# Altium schematic sheet 101_Power.SchDoc: Power DevKIT
size A2; Organization: Greenfield Tech Solutions; Address1: Molendreef 33; Address2: Ossendrecht; Address3: 4641CS; Address4: The Netherlands; SheetNumber: 2; SheetTotal: 8
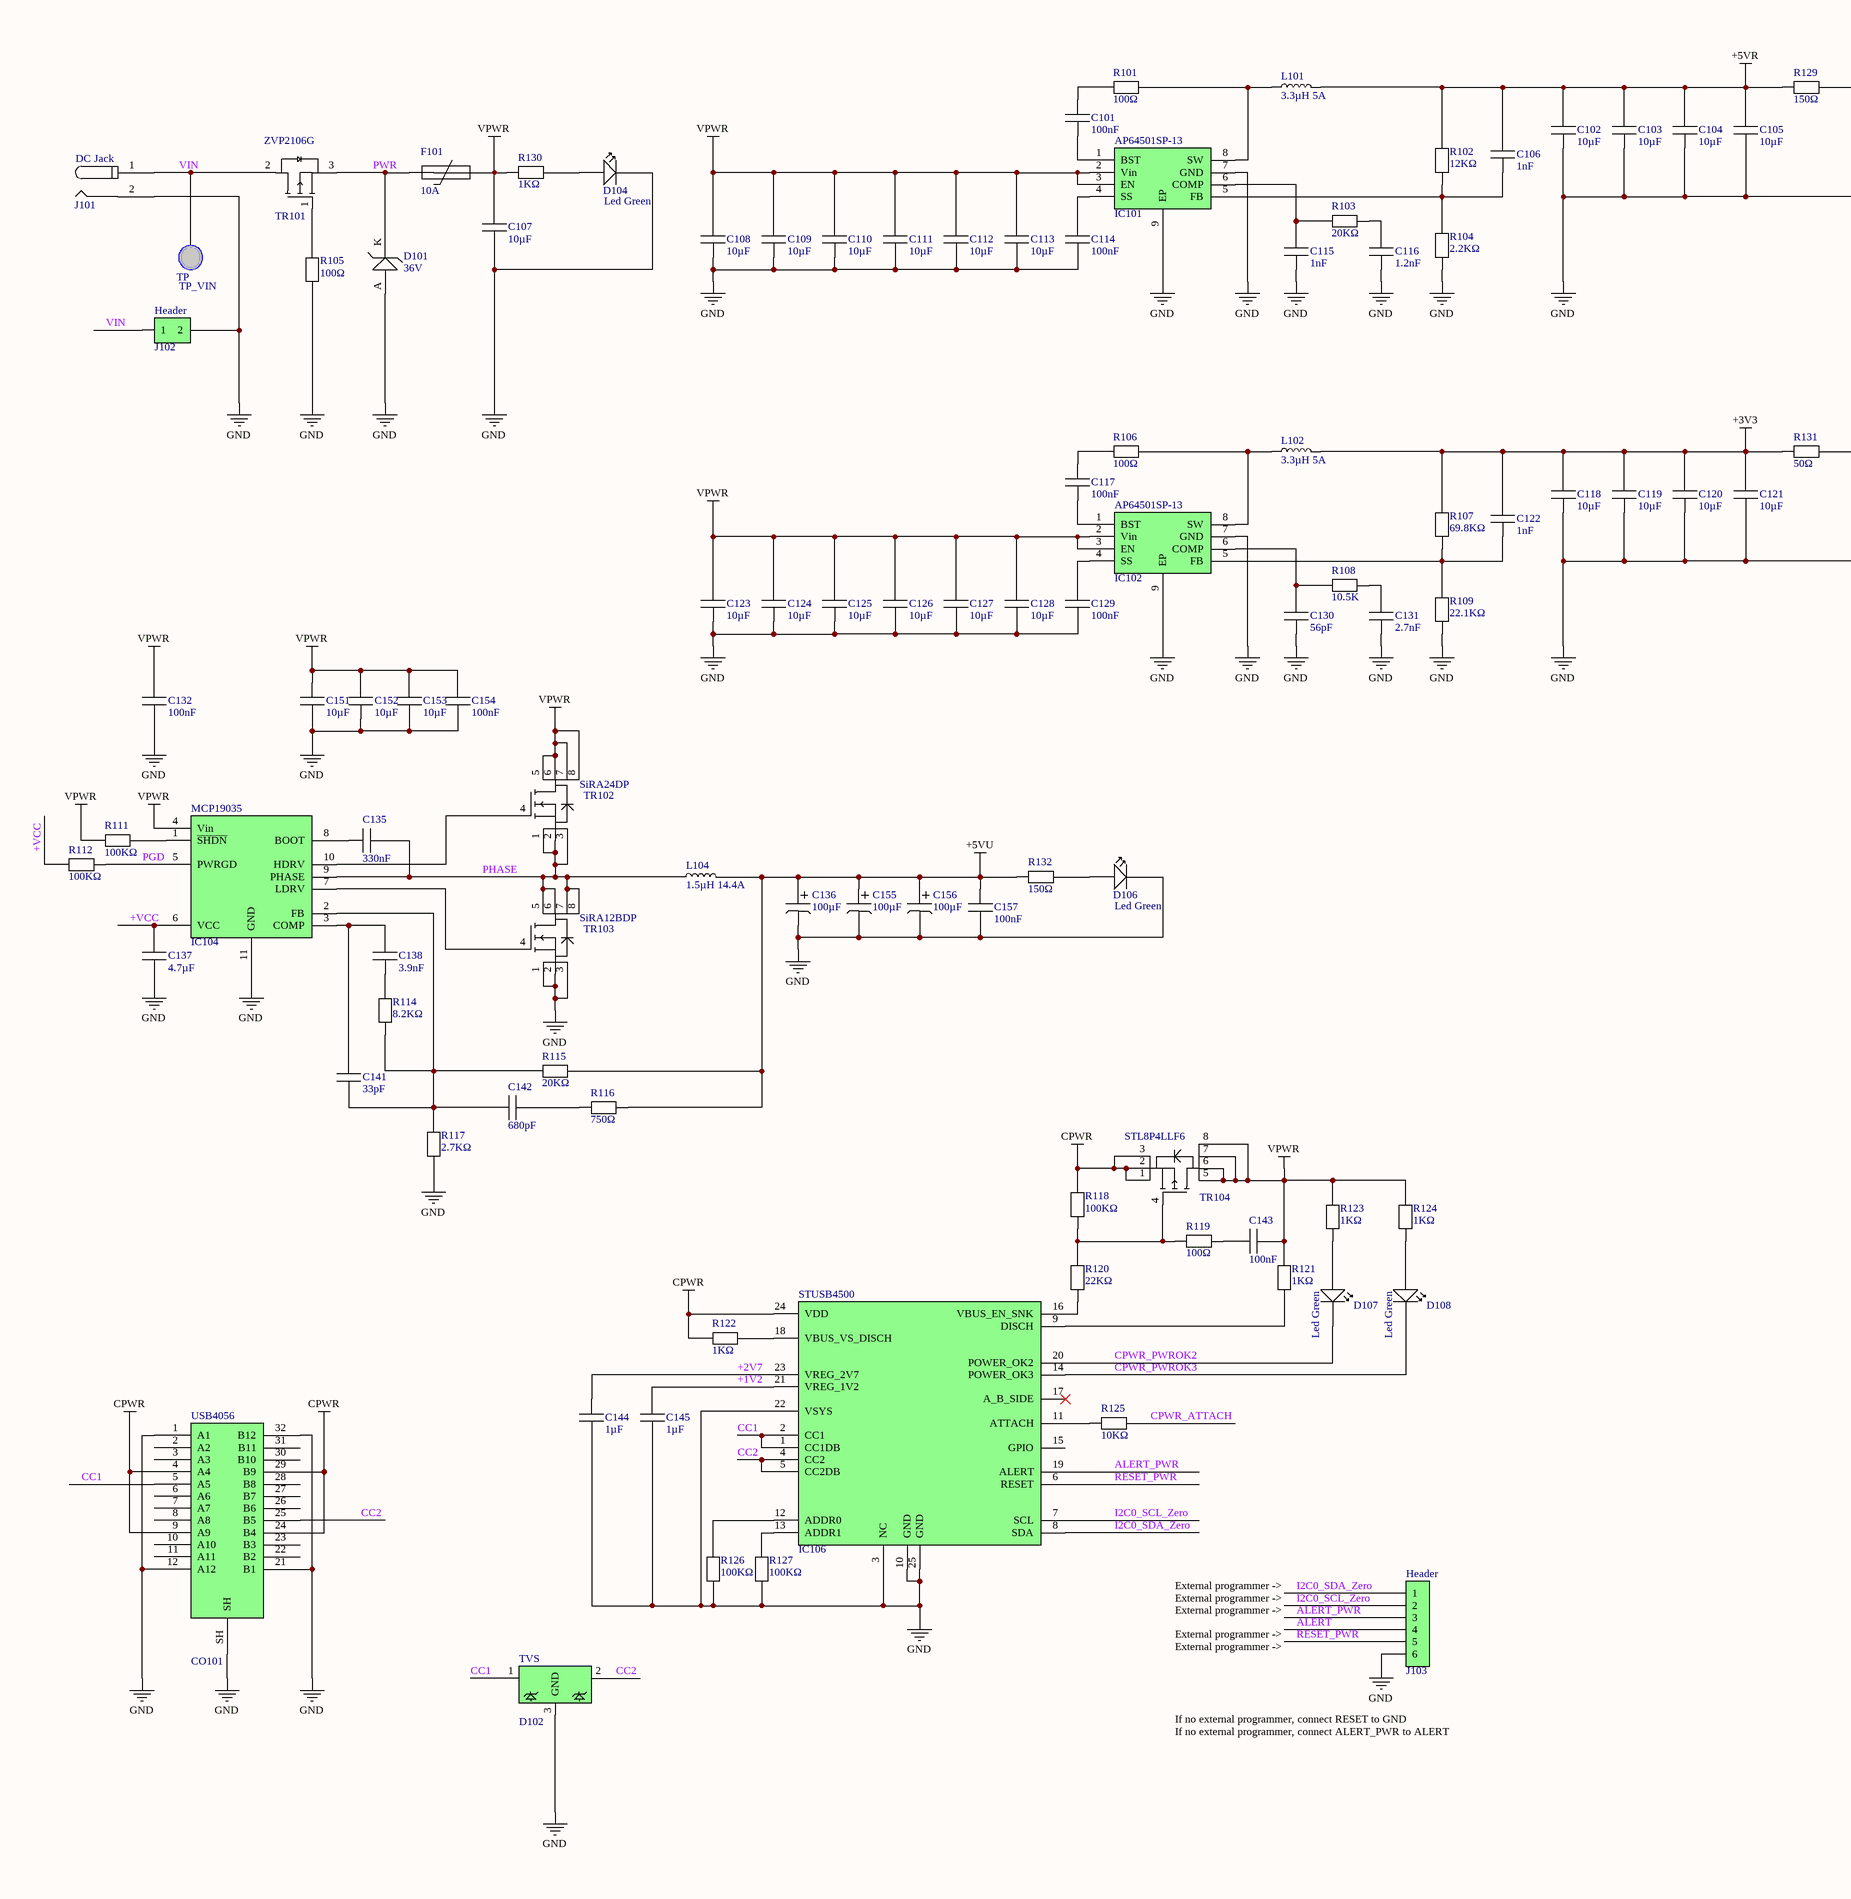
[diagram p0: 101_Power.SchDoc, left]
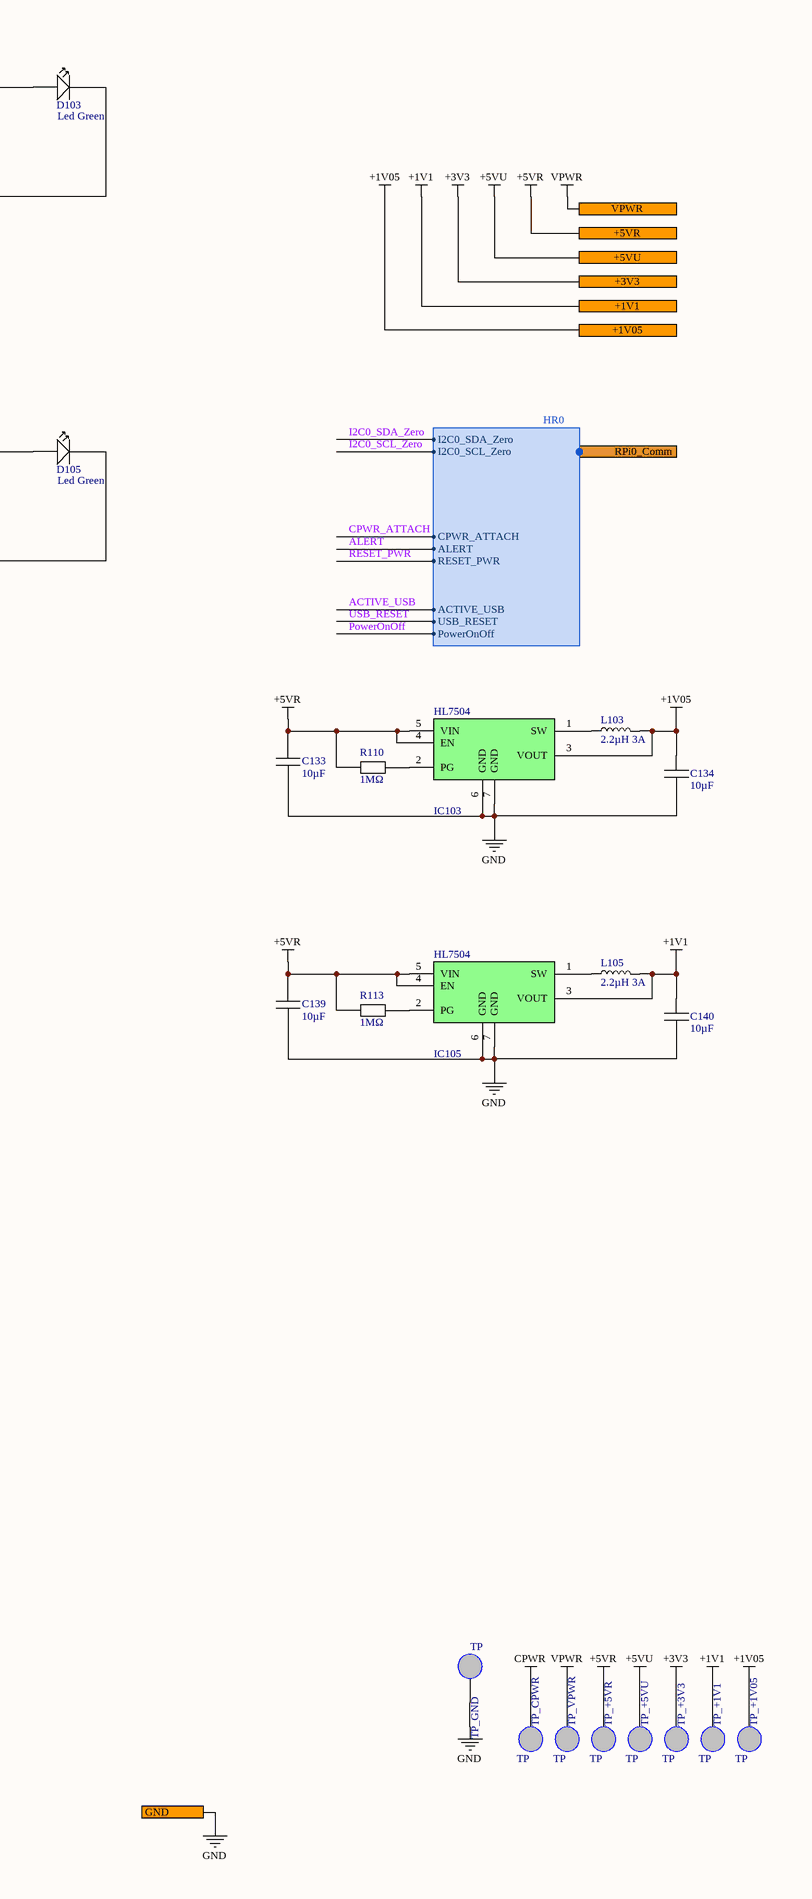
[diagram p1: 101_Power.SchDoc, right]

## Parts
C101  100nF  [C0402]
C102  10µF  [C0805]
C103  10µF  [C0805]
C104  10µF  [C0805]
C105  10µF  [C0805]
C106  1nF  [C0402]
C107  10µF  [C1210]
C108  10µF  [C0805]
C109  10µF  [C0805]
C110  10µF  [C0805]
C111  10µF  [C0805]
C112  10µF  [C0805]
C113  10µF  [C0805]
C114  100nF  [C0402]
C115  1nF  [C0402]
C116  1.2nF  [C0402]
C117  100nF  [C0402]
C118  10µF  [C0805]
C119  10µF  [C0805]
C120  10µF  [C0805]
C121  10µF  [C0805]
C122  1nF  [C0402]
C123  10µF  [C0805]
C124  10µF  [C0805]
C125  10µF  [C0805]
C126  10µF  [C0805]
C127  10µF  [C0805]
C128  10µF  [C0805]
C129  100nF  [C0402]
C130  56pF  [C0402]
C131  2.7nF  [C0402]
C132  100nF  [C0805]
C133  10µF  [C0603]
C134  10µF  [C0603]
C135  330nF  [C0603]
C136  100µF  [RL_6.3_2.5_11]
C137  4.7µF  [C0603]
C138  3.9nF  [C0402]
C139  10µF  [C0603]
C140  10µF  [C0603]
C141  33pF  [C0402]
C142  680pF  [C0402]
C143  100nF  [C0402]
C144  1µF  [C0603]
C145  1µF  [C0603]
C151  10µF  [C1210]
C152  10µF  [C1210]
C153  10µF  [C1210]
C154  100nF  [C0805]
C155  100µF  [RL_6.3_2.5_11]
C156  100µF  [RL_6.3_2.5_11]
C157  100nF  [C0805]
CO101  USB4056  [USB4056-03-A]
D101  36V  [SOD-323]
D102  TVS  [SOT-323]
D103  Led Green  [Led0805]
D104  Led Green  [Led0805]
D105  Led Green  [Led0805]
D106  Led Green  [Led0805]
D107  Led Green  [Led0805]
D108  Led Green  [Led0805]
F101  10A  [F1206]
IC101  AP64501SP-13  [SO-8-EP]
IC102  AP64501SP-13  [SO-8-EP]
IC103  HL7504  [DFN-6G_2X2]
IC104  MCP19035  [DFN-10G_3X3]
IC105  HL7504  [DFN-6G_2X2]
IC106  STUSB4500  [QFN-24G_4X4]
J101  DC Jack  [PJ-082BH]
J102  Header  [1X2P_2.54mm]
J103  Header  [1X6P_2.54MM_SMT]
L101  3.3µH 5A  [SRN6045TA]
L102  3.3µH 5A  [SRN6045TA]
L103  2.2µH 3A  [NRS4018]
L104  1.5µH 14.4A  [0630CDMCDDS]
L105  2.2µH 3A  [NRS4018]
R101  100Ω  [R0603]
R102  12KΩ  [R0402]
R103  20KΩ  [R0402]
R104  2.2KΩ  [R0402]
R105  100Ω  [R0603]
R106  100Ω  [R0603]
R107  69.8KΩ  [R0603]
R108  10.5K  [R0402]
R109  22.1KΩ  [R0603]
R110  1MΩ  [R0402]
R111  100KΩ  [R0402]
R112  100KΩ  [R0402]
R113  1MΩ  [R0402]
R114  8.2KΩ  [R0402]
R115  20KΩ  [R0402]
R116  750Ω  [R0402]
R117  2.7KΩ  [R0402]
R118  100KΩ  [R0402]
R119  100Ω  [R0603]
R120  22KΩ  [R0402]
R121  1KΩ  [R0603]
R122  1KΩ  [R0603]
R123  1KΩ  [R0402]
R124  1KΩ  [R0402]
R125  10KΩ  [R0402]
R126  100KΩ  [R0402]
R127  100KΩ  [R0402]
R129  150Ω  [R0603]
R130  1KΩ  [R0603]
R131  50Ω  [R0603]
R132  150Ω  [R0603]
TP_+1V1  TP  [TP_1MM]
TP_+1V05  TP  [TP_1MM]
TP_+3V3  TP  [TP_1MM]
TP_+5VR  TP  [TP_1MM]
TP_+5VU  TP  [TP_1MM]
TP_CPWR  TP  [TP_1MM]
TP_GND  TP  [TP_1MM]
TP_VIN  TP  [TP_1MM]
TP_VPWR  TP  [TP_1MM]
TR101  ZVP2106G  [SOT-223]
TR102  SiRA24DP  [PowerPAK-SO-8_5X6]
TR103  SiRA12BDP  [PowerPAK-SO-8_5X6]
TR104  STL8P4LLF6  [PowerFLAT-3.3x3.3-8]

## Ports
+1V1, +1V05, +3V3, +5VR, +5VU, GND, RPi0_Comm (harness HR0), VPWR

## Harnesses
HR0: I2C0_SCL_Zero, I2C0_SDA_Zero, CPWR_ATTACH, PowerOnOff, USB_RESET, ACTIVE_USB, ALERT, RESET_PWR

## Nets
+1V1: C140.1 IC105.3(VOUT) L105.2 TP_+1V1.1 ; port +1V1
+1V05: C134.1 IC103.3(VOUT) L103.2 TP_+1V05.1 ; port +1V05
+3V3: C118.1 C119.1 C120.1 C121.1 C122.1 L102.2 R107.2 R131.1 TP_+3V3.1 ; port +3V3
+5VR: C102.1 C103.1 C104.1 C105.1 C106.1 C133.1 C139.1 IC103.4(EN) IC103.5(VIN) IC105.4(EN) IC105.5(VIN) L101.2 R102.2 R110.1 R113.1 R129.1 TP_+5VR.1 ; port +5VR
+5VU: C136.1 C155.1 C156.1 C157.1 L104.2 R115.2 R116.2 R132.1 TP_+5VU.1 ; port +5VU
CPWR: CO101.4(A4) CO101.9(A9) CO101.24(B4) CO101.29(B9) IC106.24(VDD) R118.2 R122.1 TP_CPWR.1 TR104.1(S) TR104.2(S) TR104.3(S)
GND: C102.2 C103.2 C104.2 C105.2 C107.2 C108.2 C109.2 C110.2 C111.2 C112.2 C113.2 C114.2 C115.2 C116.2 C118.2 C119.2 C120.2 C121.2 C123.2 C124.2 C125.2 C126.2 C127.2 C128.2 C129.2 C130.2 C131.2 C132.2 C133.2 C134.2 C136.2 C137.2 C139.2 C140.2 C144.2 C145.2 C151.2 C152.2 C153.2 C154.2 C155.2 C156.2 C157.2 CO101.1(A1) CO101.12(A12) CO101.21(B1) CO101.32(B12) CO101.SH D101.A D102.3(GND) D103.K D104.K D105.K D106.K IC101.7(GND) IC101.9(EP) IC102.7(GND) IC102.9(EP) IC103.6(GND) IC103.7(GND) IC104.11(GND) IC105.6(GND) IC105.7(GND) IC106.3(NC) IC106.10(GND) IC106.22(VSYS) IC106.25(GND) J101.2 J102.2 J103.6 R104.1 R105.1 R109.1 R117.1 R126.1 R127.1 TP_GND.1 TR103.1(S) TR103.2(S) TR103.3(S) ; port GND
VPWR: C107.1 C108.1 C109.1 C110.1 C111.1 C112.1 C113.1 C123.1 C124.1 C125.1 C126.1 C127.1 C128.1 C132.1 C143.2 C151.1 C152.1 C153.1 C154.1 F101.2 IC101.2(Vin) IC101.3(EN) IC102.2(Vin) IC102.3(EN) IC104.4(Vin) R111.1 R121.2 R123.2 R124.2 R130.1 TP_VPWR.1 TR102.5(D) TR102.6(D) TR102.7(D) TR102.8(D) TR104.5(D) TR104.6(D) TR104.7(D) TR104.8(D) ; port VPWR
+1V2: C145.1 IC106.21(VREG_1V2)
+2V7: C144.1 IC106.23(VREG_2V7)
+VCC: C137.1 IC104.6(VCC) R112.1
ACTIVE_USB: port RPi0_Comm.ACTIVE_USB
ALERT: J103.4 ; port RPi0_Comm.ALERT
ALERT_PWR: IC106.19(ALERT) J103.3
CC1: CO101.5(A5) D102.1 IC106.1(CC1DB) IC106.2(CC1)
CC2: CO101.25(B5) D102.2 IC106.4(CC2) IC106.5(CC2DB)
CPWR_ATTACH: R125.2 ; port RPi0_Comm.CPWR_ATTACH
CPWR_PWROK2: D107.K IC106.20(POWER_OK2)
CPWR_PWROK3: D108.K IC106.14(POWER_OK3)
I2C0_SCL_Zero: IC106.7(SCL) J103.2 ; port RPi0_Comm.I2C0_SCL_Zero
I2C0_SDA_Zero: IC106.8(SDA) J103.1 ; port RPi0_Comm.I2C0_SDA_Zero
PGD: IC104.5(PWRGD) R112.2
PHASE: C135.2 IC104.9(PHASE) L104.1 TR102.1(S) TR102.2(S) TR102.3(S) TR103.5(D) TR103.6(D) TR103.7(D) TR103.8(D)
PowerOnOff: port RPi0_Comm.PowerOnOff
PWR: D101.K F101.1 TR101.3(S)
RESET_PWR: IC106.6(RESET) J103.5 ; port RPi0_Comm.RESET_PWR
USB_RESET: port RPi0_Comm.USB_RESET
VIN: J101.1 J102.1 TP_VIN.1 TR101.2(D)
NetC101_1: C101.1 R101.1
NetC101_2: C101.2 IC101.1(BST)
NetC106_2: C106.2 IC101.5(FB) R102.1 R104.2
NetC114_1: C114.1 IC101.4(SS)
NetC115_1: C115.1 IC101.6(COMP) R103.2
NetC116_1: C116.1 R103.1
NetC117_1: C117.1 R106.1
NetC117_2: C117.2 IC102.1(BST)
NetC122_2: C122.2 IC102.5(FB) R107.1 R109.2
NetC129_1: C129.1 IC102.4(SS)
NetC130_1: C130.1 IC102.6(COMP) R108.2
NetC131_1: C131.1 R108.1
NetC135_1: C135.1 IC104.8(BOOT)
NetC138_1: C138.1 C141.1 IC104.3(COMP)
NetC138_2: C138.2 R114.2
NetC141_2: C141.2 C142.1 IC104.2(FB) R114.1 R115.1 R117.2
NetC142_2: C142.2 R116.1
NetC143_1: C143.1 R119.2
NetD103_A: D103.A R129.2
NetD104_A: D104.A R130.2
NetD105_A: D105.A R131.2
NetD106_A: D106.A R132.2
NetD107_A: D107.A R123.1
NetD108_A: D108.A R124.1
NetIC101_8: IC101.8(SW) L101.1 R101.2
NetIC102_8: IC102.8(SW) L102.1 R106.2
NetIC103_1: IC103.1(SW) L103.1
NetIC103_2: IC103.2(PG) R110.2
NetIC104_1: IC104.1(~{SHDN}) R111.2
NetIC104_7: IC104.7(LDRV) TR103.4(G)
NetIC104_10: IC104.10(HDRV) TR102.4(G)
NetIC105_1: IC105.1(SW) L105.1
NetIC105_2: IC105.2(PG) R113.2
NetIC106_9: IC106.9(DISCH) R121.1
NetIC106_11: IC106.11(ATTACH) R125.1
NetIC106_12: IC106.12(ADDR0) R126.2
NetIC106_13: IC106.13(ADDR1) R127.2
NetIC106_16: IC106.16(VBUS_EN_SNK) R120.1
NetIC106_18: IC106.18(VBUS_VS_DISCH) R122.2
NetR105_2: R105.2 TR101.1(G)
NetR118_1: R118.1 R119.1 R120.2 TR104.4(G)

Not connected (* = marked no-connect by the designer): CO101 2(A2) 3(A3) 6(A6) 7(A7) 8(A8) 10(A10) 11(A11) 22(B2) 23(B3) 26(B6) 27(B7) 28(B8) 30(B10) 31(B11); IC106 15(GPIO) 17(A_B_SIDE)*

## Notes on the sheet
- External programmer ->
- If no external programmer, connect RESET to GND
- If no external programmer, connect ALERT_PWR to ALERT
- Title
- Size:
- Date:
- File:
- A2
- Number:
- Time:
- Revision:
- Sheet
- of

## Library data of the parts
C101 C114 C117 C129 C143 = CA0029: 100nF 50V 10% X7R; Part Number: CA0029; ManfactPart: CGA2B3X7R1H104K050BB; ID: 29; RefVal: 100nF
C102-C105 C118-C121 = CA0001: 10µF 16V 10% X5R; Part Number: CA0001; ManfactPart: GRM21BR61C106KE15L; ID: 1; RefVal: 10µF
C106 C115 C122 = CA0031: 1nF 50V 1% C0G; Part Number: CA0031; ManfactPart: GRT1555C1H102FA02D; ID: 31; RefVal: 1nF
C107 C151-C153 = CA0024: 10µF 63V 10% X7R; Part Number: CA0024; ManfactPart: GRM32ER71J106KA12; ID: 24; RefVal: 10µF
C108-C113 C123-C128 = CA0005: 10µF 35V 10% X5R; Part Number: CA0005; ManfactPart: C2012X5R1V106K125AC; ID: 5; RefVal: 10µF
C116 = CA0030: 1.2nF 50V 10% X7R; Part Number: CA0030; ManfactPart: GCM155R71H122KA37D; ID: 30; RefVal: 1.2nF
C130 = CA0068: 56pF 50V 2% C0G; Part Number: CA0068; ManfactPart: CC0402GRNPO9BN560; ID: 68; RefVal: 56pF
C131 = CA0055: 2.7nF 50V 5% X7R; Part Number: CA0055; ManfactPart: GRM155R71H272JA01D; ID: 55; RefVal: 2.7nF
C132 C154 C157 = CA0023: 100nF 50V 20% X7R; Part Number: CA0023; ManfactPart: C0805C104M5RAC; ID: 23; RefVal: 100nF
C133 C134 C139 C140 = CA0008: 10µF 16V 20% X5R; Part Number: CA0008; ManfactPart: GRM188R61C106MAALD; ID: 8; RefVal: 10µF
C135 = CA0004: 330nF 35V 10% X5R; Part Number: CA0004; ManfactPart: CGA3E3X5R1V334K080AB; ID: 4; RefVal: 330nF
C136 C155 C156 = CA0050: 100µF 35V 20% 231mA; Part Number: CA0050; ManfactPart: 860010573007; ID: 50; RefVal: 100µF
C137 = CA0002: 4.7µF 16V 10% X5R; Part Number: CA0002; ManfactPart: C1608X5R1C475K080AC; ID: 2; RefVal: 4.7µF
C138 = CA0066: 3.9nF 50V 10% X7R; Part Number: CA0066; ManfactPart: GCM155R71H392KA37D; ID: 66; RefVal: 3.9nF
C141 = CA0067: 33pF 50V 5% C0G; Part Number: CA0067; ManfactPart: C1005C0G1H330J050BA; ID: 67; RefVal: 33pF
C142 = CA0065: 680pF 50V 10% X7R; Part Number: CA0065; ManfactPart: C0402C681K5RAC; ID: 65; RefVal: 680pF
C144 C145 = CA0003: 1µF 16V 10% X5R; Part Number: CA0003; ManfactPart: C1608X5R1C105K080AA; ID: 3; RefVal: 1µF
CO101 = CO0030: USB C connector Receptacle Horizontal; Part Number: CO0030; ID: 29; RefVal: USB4056; ManfactPart: USB4056-03-A
D101 = DI0008: Zener Diode 36V 200mW; Part Number: DI0008; ManfactPart: BZT52C36S; ID: 8; RefVal: 36V
D102 = DI0009: TRANSIL array for data protection; Part Number: DI0009; ManfactPart: ESDA25W; ID: 9; RefVal: TVS
D103-D108 = DI0001: Part Number: DI0001; ManfactPart: KP-2012CGCK; ID: 1; RefVal: Led Green
F101 = F0004: 32V/10A; Part Number: F0004; ManfactPart: C1H10; ID: 4; RefVal: 10A
IC101 IC102 = IC0031: 3.8V TO 40V INPUT, 5A LOW IQ SYNCHRONOUS BUCK WITH PROGRAMMABLE SOFT-START TIME; Part Number: IC0031; ID: 31; RefVal: AP64501SP-13; ManfactPart: AP64501SP-13
IC103 = IC0049: 3MHz 2A Buck Converter 1.05V OUT; Part Number: IC0049; ManfactPart: HL7504FN04; ID: 49; RefVal: HL7504
IC104 = IC0055: Switching Controllers Synchronous Buck PWM Control 600kHz 12ns; Part Number: IC0055; ManfactPart: MCP19035-BAABE/MF; ID: 55; RefVal: MCP19035
IC105 = IC0050: 3MHz 2A Buck Converter 1.10V OUT; Part Number: IC0050; ManfactPart: HL7504FN08; ID: 50; RefVal: HL7504
IC106 = IC0057: USB Interface IC Standalone USB PD controller for power sinking devices; Part Number: IC0057; ManfactPart: STUSB4500QTR; ID: 57; RefVal: STUSB4500
J101 = CO0015: DC Jack 36V @10A; Part Number: CO0015; ID: 22; RefVal: DC Jack; ManfactPart: PJ-082BH
J102 = CO0012: Header 1x2P; Part Number: CO0012; ManfactPart: G800W306018EU; ID: 12; RefVal: Header
J103 = CO0043: Header 1x6P SMT Mount; Part Number: CO0043; ManfactPart: G800MJ302018EU; ID: 43; RefVal: Header
L101 L102 = IN0005: 3.3µH 5A 30% 21mΩ; Part Number: IN0005; ManfactPart: SRN6045TA-3R3Y; ID: 5; RefVal: 3.3µH 5A
L103 L105 = IN0004: Part Number: IN0004; ManfactPart: NRS4018T2R2MDGJ; ID: 4; RefVal: 2.2µH 3A
L104 = IN0017: 1.5µH 14.4A 20% 7.4mΩ; Part Number: IN0017; ManfactPart: 0630CDMCDDS-1R0MC; ID: 17; RefVal: 1.5µH 14.4A
R101 R105 R106 R119 = RS0007: 100Ω 1% 100mW; Part Number: RS0007; ManfactPart: WR06X1000FTL; ID: 7; RefVal: 100Ω
R102 = RS0015: 12KΩ 1% 62.5mW; Part Number: RS0015; ManfactPart: RC0402FR-1312KL; ID: 15; RefVal: 12KΩ
R103 R115 = RS0034: 20KΩ 1% 100mW 100PPM; Part Number: RS0034; ManfactPart: ERJ-S02F2002X; ID: 34; RefVal: 20KΩ
R104 = RS0035: 2.2KΩ 1% 62.5mW 100PPM; Part Number: RS0035; ManfactPart: CRGCQ0402F2K2; ID: 35; RefVal: 2.2KΩ
R107 = RS0041: 69.8KΩ 1% 100mW 100PPM; Part Number: RS0041; ManfactPart: CRCW060369K8FKEB; ID: 41; RefVal: 69.8KΩ
R108 = RS0054: 10.5KΩ 1% 62.5mW 100PPM; Part Number: RS0054; ManfactPart: CRCW040210K5FKEDC; ID: 54; RefVal: 10.5K
R109 = RS0040: 22.1KΩ 1% 100mW 100PPM; Part Number: RS0040; ManfactPart: RC0603FR-0722K1L; ID: 40; RefVal: 22.1KΩ
R110 R113 = RS0066: 1MΩ 1% 62.5mW 100PPM; Part Number: RS0066; ManfactPart: 0402WGF1004TCE; ID: 66; RefVal: 1MΩ
R111 R112 R118 R126 R127 = RS0036: 100KΩ 1% 62.5mW 100PPM; Part Number: RS0036; ManfactPart: AC0402FR-13100KL; ID: 36; RefVal: 100KΩ
R114 = RS0079: 8.2KΩ 1% 62.5mW 100PPM; Part Number: RS0079; ManfactPart: 0402WGF8201TCE; ID: 79; RefVal: 8.2KΩ
R116 = RS0078: 750Ω 1% 62.5mW 100PPM; Part Number: RS0078; ManfactPart: CRG0402F750R; ID: 78; RefVal: 750Ω
R117 = RS0059: 2.7KΩ 1% 62.5mW 100PPM; Part Number: RS0059; ManfactPart: CRG0402F2K7; ID: 59; RefVal: 2.7KΩ
R120 = RS0033: 22KΩ 1% 62.5mW 100PPM; Part Number: RS0033; ManfactPart: MCWR04X2202FTL; ID: 33; RefVal: 22KΩ
R121 R122 R130 = RS0008: 1KΩ 5% 100mW; Part Number: RS0008; ManfactPart: WR06X102 JTL; ID: 8; RefVal: 1KΩ
R123 R124 = RS0037: 1KΩ 5% 62.5mW 100PPM; Part Number: RS0037; ManfactPart: RC0402JR-131KL; ID: 37; RefVal: 1KΩ
R125 = RS0011: 10KΩ 1% 62.5mW; Part Number: RS0011; ManfactPart: WR04X1002FTL; ID: 11; RefVal: 10KΩ
R129 R132 = RS0001: 150Ω 1% 100mW; Part Number: RS0001; ManfactPart: MCWR06X1500FTL; ID: 1; RefVal: 150Ω
R131 = RS0080: 50Ω 0.1% 100mW 50PPM; Part Number: RS0080; ManfactPart: RT0603BRE0750RL; ID: 80; RefVal: 50Ω
TP_+1V1 TP_+1V05 TP_+3V3 TP_+5VR TP_+5VU TP_CPWR TP_GND TP_VIN TP_VPWR = ME0027: Testpoint 1mm; Part Number: ME0027; ID: 27; RefVal: TP
TR101 = TR0007: 36V-PNP-E; Part Number: TR0007; ManfactPart: ZVP2106GTA; ID: 7; RefVal: ZVP2106G
TR102 = TR0012: 25V/2.4mΩ, N-channel Power MOSFET, 35.6A; Part Number: TR0012; ManfactPart: SIRA24DP-T1-GE3; ID: 12; RefVal: SiRA24DP
TR103 = TR0013: 30V/6mΩ, N-channel Power MOSFET, 22A; Part Number: TR0013; ManfactPart: SIRA12BDP-T1-GE3; ID: 13; RefVal: SiRA12BDP
TR104 = TR0010: 40V/17.5mΩ, P-channel Trench MOSFET, 8A; Part Number: TR0010; ID: 10; RefVal: STL8P4LLF6; ManfactPart: STL8P4LLF6